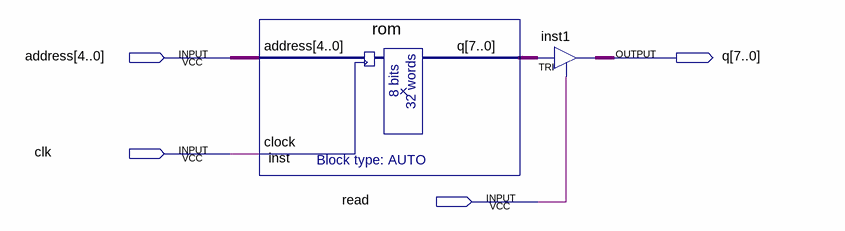
[diagram p0: schematic sheet]
// Quartus schematic rom0.bdf as structural Verilog: 2 symbols, 4 pins
module rom0 (
  input  [4:0] address,
  input  clk,
  input  read,
  output [7:0] q
);

  wire [7:0] inst_q;

  rom inst (.address(address), .clock(clk), .q(inst_q));
  TRI inst1[7:0] (.IN(inst_q), .OE(read), .OUT(q));
endmodule
